# Altium schematic sheet Flex-LED.SchDoc
size A; SheetNumber: 1; SheetTotal: 1
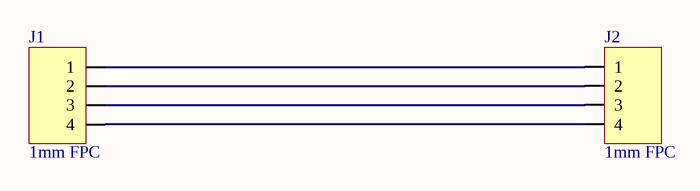
[diagram p0: Flex-LED.SchDoc]

## Parts
J1  1mm FPC  [FPC-1mm-4P]
J2  1mm FPC  [FPC-1mm-4P]

## Nets
NetJ1_1: J1.1 J2.1
NetJ1_2: J1.2 J2.2
NetJ1_3: J1.3 J2.3
NetJ1_4: J1.4 J2.4

## Library data of the parts
J1 J2 = FPC-1mm-4P: 1mm Pitch 4P FPC